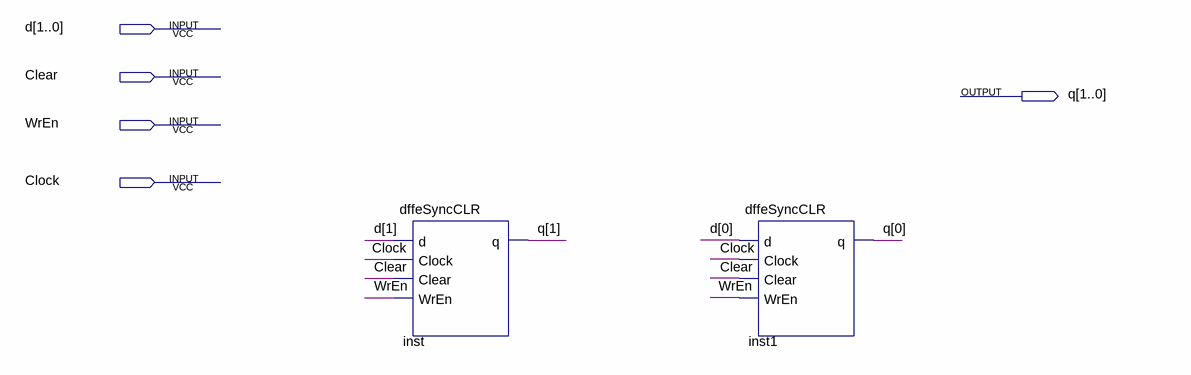
[diagram p0: schematic sheet]
// Quartus schematic Register2.bdf as structural Verilog: 2 symbols, 5 pins
module Register2 (
  input  [1:0] d,
  input  Clear,
  input  WrEn,
  input  Clock,
  output [1:0] q
);

  dffeSyncCLR inst (.d(d[1]), .Clock(Clock), .Clear(Clear), .WrEn(WrEn), .q(q[1]));
  dffeSyncCLR inst1 (.d(d[0]), .Clock(Clock), .Clear(Clear), .WrEn(WrEn), .q(q[0]));
endmodule
